# Altium schematic sheet RS232&IrDA.SchDoc
size A4; Revision: B.2(PCB.SCH)
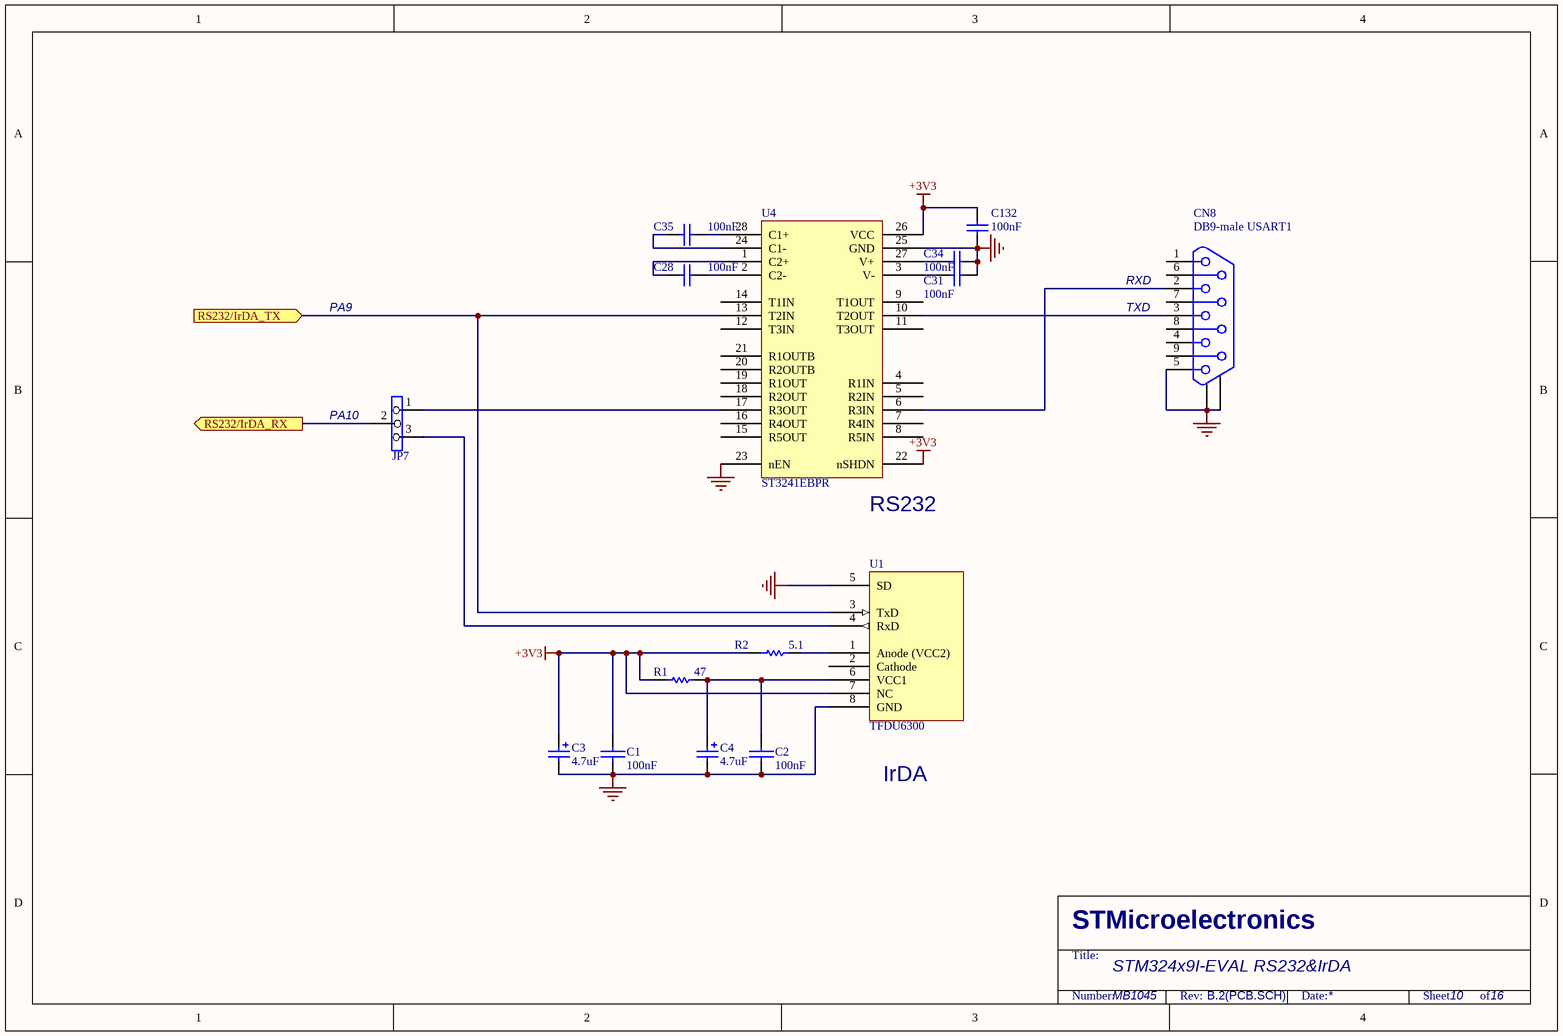
[diagram p0: RS232&IrDA.SchDoc]

## Parts
C1  100nF  [0603C]
C2  100nF  [0603C]
C3  4.7uF  [TAN-A]
C4  4.7uF  [TAN-A]
C28  100nF  [0603C]
C31  100nF  [0603C]
C34  100nF  [0603C]
C35  100nF  [0603C]
C132  100nF  [0603C]
CN8  DB9-male USART1  [DB9/M]
JP7  (no value)  [SIP3]
R1  47  [0603R]
R2  5.1  [0603R]
U1  TFDU6300  [IR_VISHAY3]
U4  ST3241EBPR  [SSOP28_0R65_10R2X7R8]

## Ports
RS232/IrDA_RX (out), RS232/IrDA_TX (in)

## Nets
+3V3: C1.1 C3.1 C132.1 R1.1 R2.1 U1.7(NC) U4.22(nSHDN) U4.26(VCC)
GND: C1.2 C2.2 C3.2 C4.2 C31.1 C34.1 C132.2 CN8.5 CN8.10 CN8.11 U1.5(SD) U1.8(GND) U4.23(nEN) U4.25(GND)
RS232/IrDA_RX: JP7.2 ; port RS232/IrDA_RX
RS232/IrDA_TX: U1.3(TxD) U4.13(T2IN) ; port RS232/IrDA_TX
NetC2_1: C2.1 C4.1 R1.2 U1.6(VCC1)
NetC28_1: C28.1 U4.1(C2+)
NetC28_2: C28.2 U4.2(C2-)
NetC31_2: C31.2 U4.3(V-)
NetC34_2: C34.2 U4.27(V+)
NetC35_1: C35.1 U4.24(C1-)
NetC35_2: C35.2 U4.28(C1+)
NetCN8_2: CN8.2 U4.6(R3IN)
NetCN8_3: CN8.3 U4.10(T2OUT)
NetJP7_1: JP7.1 U4.17(R3OUT)
NetJP7_3: JP7.3 U1.4(RxD)
NetR2_2: R2.2 U1.1(Anode_(VCC2))

Not connected (* = marked no-connect by the designer): CN8 1 4 6 7 8 9; U1 2(Cathode); U4 4(R1IN) 5(R2IN) 7(R4IN) 8(R5IN) 9(T1OUT) 11(T3OUT) 12(T3IN) 14(T1IN) 15(R5OUT) 16(R4OUT) 18(R2OUT) 19(R1OUT) 20(R2OUTB) 21(R1OUTB)

## Notes on the sheet
- PA9
- (near CN8) RXD
- (near CN8) TXD
- (near JP7) PA10
- (near U4) RS232
- IrDA
- STM324x9I-EVAL RS232&IrDA
- MB1045
- 10
- 16
- STMicroelectronics
- Title:
- Number:
- Rev:
- Date:
- Sheet          of

## Library data of the parts
C1 C2 = CAP: Capacitor
C3 C4 = Cap Pol1: Polarized Capacitor (Radial); Value: 100pF; Published: 8-Jun-2000; Revision: July-2002: Re-released for DXP Platform.; Publisher: Altium Limited
C28 C31 C34 C35 C132 = Cap: Capacitor; Value: 10nF; Published: 8-Jun-2000; Revision: July-2002: Re-released for DXP Platform.; Publisher: Altium Limited
CN8 = DB9-USART
JP7 = Jumper3
R1 R2 = Res1: Resistor; Value: 1K; Published: 8-Jun-2000; Revision: July-2002: Re-released for DXP Platform.; Publisher: Altium Limited
U1 = TFDU4300
U4 = ST3241